# EAGLE schematic Microcontroller_STM_STM32F303CX (EAGLE 6.5.0)
Microcontroller: STM32F303Cx STM32F303CC <http://www.st.com/web/en/catalog/mmc/FM141/SC1169/SS1576/LN1531/PF252051#> This sheet contains the microcontroller with all required capacitors. Capacitor C_MC_VDDA_1 is required when using A2D, optional otherwise
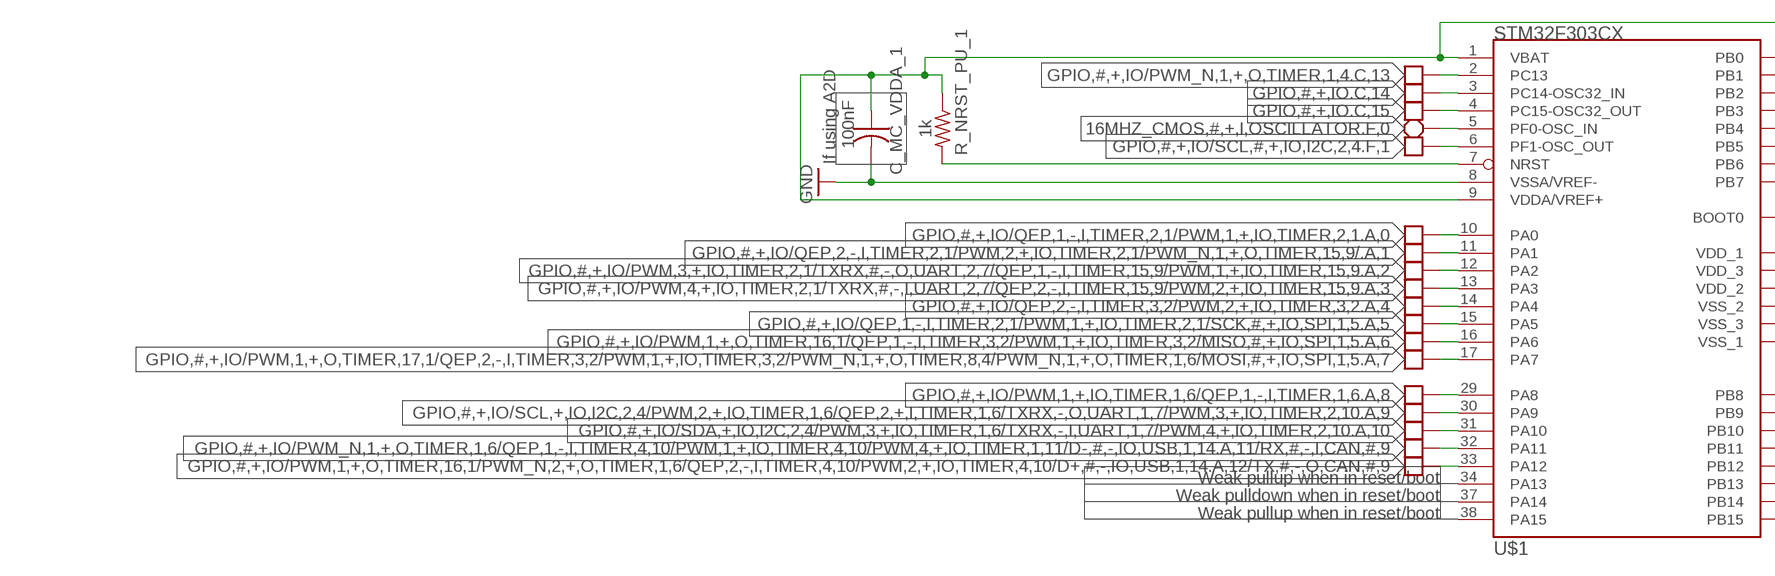
[diagram p0: schematic, sheet 1, part 1 of 2]
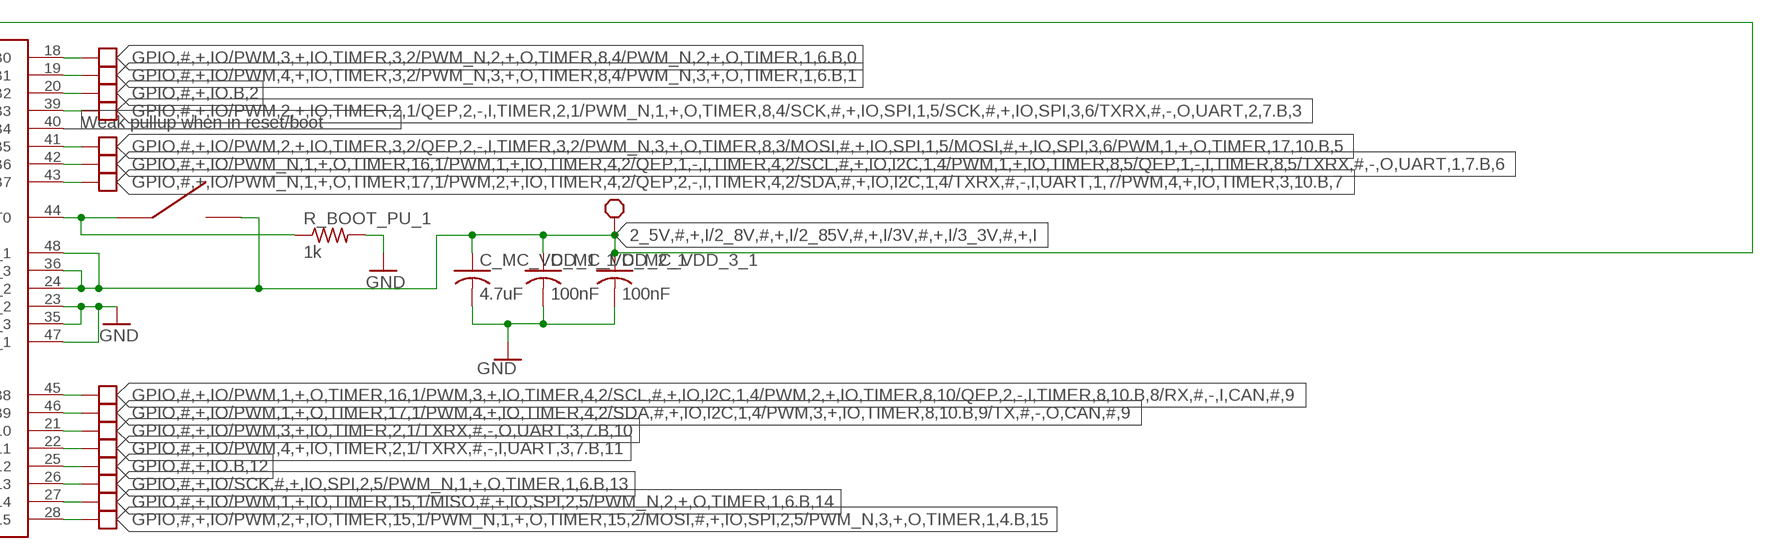
[diagram p1: schematic, sheet 1, part 2 of 2]

## Parts
C_MC_VDD_1_1  4.7uF  C-USC0603  [C0603]
C_MC_VDD_2_1  100nF  C-USC0603  [C0603]
C_MC_VDD_3_1  100nF  C-USC0603  [C0603]
C_MC_VDDA_1  100nF  C-USC0603  [C0603]
R_BOOT_PU_1  1k  R-US_R0603  [R0603]
R_NRST_PU_1  1k  R-US_R0603  [R0603]
SW1  B3U  [B3U]
U$1  STM32F303CX  [LQFP48]

## Nets
2_5V,#,+,I/2_8V,#,+,I/2_85V,#,+,I/3V,#,+,I/3_3V,#,+,I: C_MC_VDD_1_1.1 C_MC_VDD_2_1.1 C_MC_VDD_3_1.1 C_MC_VDDA_1.1 R_NRST_PU_1.1 SW1.P$2 U$1.1(VBAT) U$1.9(VDDA/VREF+) U$1.24(VDD_2) U$1.36(VDD_3) U$1.48(VDD_1) ; supply symbol labelled BLOCK_REQUIREMENT
16MHZ_CMOS,#,+,I,OSCILLATOR.F,0: U$1.5(PF0-OSC_IN) ; supply symbol labelled BLOCK_REQUIREMENT
BOOT0_1: R_BOOT_PU_1.1 SW1.P$1 U$1.44(BOOT0)
GND: C_MC_VDD_1_1.2 C_MC_VDD_2_1.2 C_MC_VDD_3_1.2 C_MC_VDDA_1.2 R_BOOT_PU_1.2 U$1.8(VSSA/VREF-) U$1.23(VSS_2) U$1.35(VSS_3) U$1.47(VSS_1)
GPIO,#,+,IO.B,2: U$1.20(PB2) ; supply symbol labelled BLOCK_OPTIONAL
GPIO,#,+,IO.B,12: U$1.25(PB12) ; supply symbol labelled BLOCK_OPTIONAL
GPIO,#,+,IO.C,14: U$1.3(PC14-OSC32_IN) ; supply symbol labelled BLOCK_OPTIONAL
GPIO,#,+,IO.C,15: U$1.4(PC15-OSC32_OUT) ; supply symbol labelled BLOCK_OPTIONAL
GPIO,#,+,IO/PWM,1,+,IO,TIMER,1,6/QEP,1,-,I,TIMER,1,6.A,8: U$1.29(PA8) ; supply symbol labelled BLOCK_OPTIONAL
GPIO,#,+,IO/PWM,1,+,IO,TIMER,15,1/MISO,#,+,IO,SPI,2,5/PWM_N,2,+,O,TIMER,1,6.B,14: U$1.27(PB14) ; supply symbol labelled BLOCK_OPTIONAL
GPIO,#,+,IO/PWM,1,+,O,TIMER,16,1/PWM,3,+,IO,TIMER,4,2/SCL,#,+,IO,I2C,1,4/PWM,2,+,IO,TIMER,8,10/QEP,2,-,I,TIMER,8,10.B,8/RX,#,-,I,CAN,#,9: U$1.45(PB8) ; supply symbol labelled BLOCK_OPTIONAL
GPIO,#,+,IO/PWM,1,+,O,TIMER,16,1/PWM_N,2,+,O,TIMER,1,6/QEP,2,-,I,TIMER,4,10/PWM,2,+,IO,TIMER,4,10/D+,#,-,IO,USB,1,14.A,12/TX,#,-,O,CAN,#,9: U$1.33(PA12) ; supply symbol labelled BLOCK_OPTIONAL
GPIO,#,+,IO/PWM,1,+,O,TIMER,16,1/QEP,1,-,I,TIMER,3,2/PWM,1,+,IO,TIMER,3,2/MISO,#,+,IO,SPI,1,5.A,6: U$1.16(PA6) ; supply symbol labelled BLOCK_OPTIONAL
GPIO,#,+,IO/PWM,1,+,O,TIMER,17,1/PWM,4,+,IO,TIMER,4,2/SDA,#,+,IO,I2C,1,4/PWM,3,+,IO,TIMER,8,10.B,9/TX,#,-,O,CAN,#,9: U$1.46(PB9) ; supply symbol labelled BLOCK_OPTIONAL
GPIO,#,+,IO/PWM,1,+,O,TIMER,17,1/QEP,2,-,I,TIMER,3,2/PWM,1,+,IO,TIMER,3,2/PWM_N,1,+,O,TIMER,8,4/PWM_N,1,+,O,TIMER,1,6/MOSI,#,+,IO,SPI,1,5.A,7: U$1.17(PA7) ; supply symbol labelled BLOCK_OPTIONAL
GPIO,#,+,IO/PWM,2,+,IO,TIMER,2,1/QEP,2,-,I,TIMER,2,1/PWM_N,1,+,O,TIMER,8,4/SCK,#,+,IO,SPI,1,5/SCK,#,+,IO,SPI,3,6/TXRX,#,-,O,UART,2,7.B,3: U$1.39(PB3) ; supply symbol labelled BLOCK_OPTIONAL
GPIO,#,+,IO/PWM,2,+,IO,TIMER,3,2/QEP,2,-,I,TIMER,3,2/PWM_N,3,+,O,TIMER,8,3/MOSI,#,+,IO,SPI,1,5/MOSI,#,+,IO,SPI,3,6/PWM,1,+,O,TIMER,17,10.B,5: U$1.41(PB5) ; supply symbol labelled BLOCK_OPTIONAL
GPIO,#,+,IO/PWM,2,+,IO,TIMER,15,1/PWM_N,1,+,O,TIMER,15,2/MOSI,#,+,IO,SPI,2,5/PWM_N,3,+,O,TIMER,1,4.B,15: U$1.28(PB15) ; supply symbol labelled BLOCK_OPTIONAL
GPIO,#,+,IO/PWM,3,+,IO,TIMER,2,1/TXRX,#,-,O,UART,2,7/QEP,1,-,I,TIMER,15,9/PWM,1,+,IO,TIMER,15,9.A,2: U$1.12(PA2) ; supply symbol labelled BLOCK_OPTIONAL
GPIO,#,+,IO/PWM,3,+,IO,TIMER,2,1/TXRX,#,-,O,UART,3,7.B,10: U$1.21(PB10) ; supply symbol labelled BLOCK_OPTIONAL
GPIO,#,+,IO/PWM,3,+,IO,TIMER,3,2/PWM_N,2,+,O,TIMER,8,4/PWM_N,2,+,O,TIMER,1,6.B,0: U$1.18(PB0) ; supply symbol labelled BLOCK_OPTIONAL
GPIO,#,+,IO/PWM,4,+,IO,TIMER,2,1/TXRX,#,-,I,UART,2,7/QEP,2,-,I,TIMER,15,9/PWM,2,+,IO,TIMER,15,9.A,3: U$1.13(PA3) ; supply symbol labelled BLOCK_OPTIONAL
GPIO,#,+,IO/PWM,4,+,IO,TIMER,2,1/TXRX,#,-,I,UART,3,7.B,11: U$1.22(PB11) ; supply symbol labelled BLOCK_OPTIONAL
GPIO,#,+,IO/PWM,4,+,IO,TIMER,3,2/PWM_N,3,+,O,TIMER,8,4/PWM_N,3,+,O,TIMER,1,6.B,1: U$1.19(PB1) ; supply symbol labelled BLOCK_OPTIONAL
GPIO,#,+,IO/PWM_N,1,+,O,TIMER,1,4.C,13: U$1.2(PC13) ; supply symbol labelled BLOCK_OPTIONAL
GPIO,#,+,IO/PWM_N,1,+,O,TIMER,1,6/QEP,1,-,I,TIMER,4,10/PWM,1,+,IO,TIMER,4,10/PWM,4,+,IO,TIMER,1,11/D-,#,-,IO,USB,1,14.A,11/RX,#,-,I,CAN,#,9: U$1.32(PA11) ; supply symbol labelled BLOCK_OPTIONAL
GPIO,#,+,IO/PWM_N,1,+,O,TIMER,16,1/PWM,1,+,IO,TIMER,4,2/QEP,1,-,I,TIMER,4,2/SCL,#,+,IO,I2C,1,4/PWM,1,+,IO,TIMER,8,5/QEP,1,-,I,TIMER,8,5/TXRX,#,-,O,UART,1,7.B,6: U$1.42(PB6) ; supply symbol labelled BLOCK_OPTIONAL
GPIO,#,+,IO/PWM_N,1,+,O,TIMER,17,1/PWM,2,+,IO,TIMER,4,2/QEP,2,-,I,TIMER,4,2/SDA,#,+,IO,I2C,1,4/TXRX,#,-,I,UART,1,7/PWM,4,+,IO,TIMER,3,10.B,7: U$1.43(PB7) ; supply symbol labelled BLOCK_OPTIONAL
GPIO,#,+,IO/QEP,1,-,I,TIMER,2,1/PWM,1,+,IO,TIMER,2,1.A,0: U$1.10(PA0) ; supply symbol labelled BLOCK_OPTIONAL
GPIO,#,+,IO/QEP,1,-,I,TIMER,2,1/PWM,1,+,IO,TIMER,2,1/SCK,#,+,IO,SPI,1,5.A,5: U$1.15(PA5) ; supply symbol labelled BLOCK_OPTIONAL
GPIO,#,+,IO/QEP,2,-,I,TIMER,2,1/PWM,2,+,IO,TIMER,2,1/PWM_N,1,+,O,TIMER,15,9/.A,1: U$1.11(PA1) ; supply symbol labelled BLOCK_OPTIONAL
GPIO,#,+,IO/QEP,2,-,I,TIMER,3,2/PWM,2,+,IO,TIMER,3,2.A,4: U$1.14(PA4) ; supply symbol labelled BLOCK_OPTIONAL
GPIO,#,+,IO/SCK,#,+,IO,SPI,2,5/PWM_N,1,+,O,TIMER,1,6.B,13: U$1.26(PB13) ; supply symbol labelled BLOCK_OPTIONAL
GPIO,#,+,IO/SCL,#,+,IO,I2C,2,4.F,1: U$1.6(PF1-OSC_OUT) ; supply symbol labelled BLOCK_OPTIONAL
GPIO,#,+,IO/SCL,+,IO,I2C,2,4/PWM,2,+,IO,TIMER,1,6/QEP,2,+,I,TIMER,1,6/TXRX,-,O,UART,1,7/PWM,3,+,IO,TIMER,2,10.A,9: U$1.30(PA9) ; supply symbol labelled BLOCK_OPTIONAL
GPIO,#,+,IO/SDA,+,IO,I2C,2,4/PWM,3,+,IO,TIMER,1,6/TXRX,-,I,UART,1,7/PWM,4,+,IO,TIMER,2,10.A,10: U$1.31(PA10) ; supply symbol labelled BLOCK_OPTIONAL
NRST_1: R_NRST_PU_1.2 U$1.7(NRST)
Unconnected: U$1.34(PA13) U$1.37(PA14) U$1.38(PA15) U$1.40(PB4)

## Notes on the sheet
- Weak pullup when in reset/boot
- If using A2D
- Weak pullup when in reset/boot
- Weak pulldown when in reset/boot
- Weak pullup when in reset/boot

## Library data of the parts
C_MC_VDD_1_1 C_MC_VDD_2_1 C_MC_VDD_3_1 C_MC_VDDA_1 = resistor:C-US: CAPACITOR, American symbol
R_BOOT_PU_1 R_NRST_PU_1 = resistor:R-US_: RESISTOR, American symbol
SW1 = zz-upenn 2:B3U
U$1 = piccoli:STM32F303CX